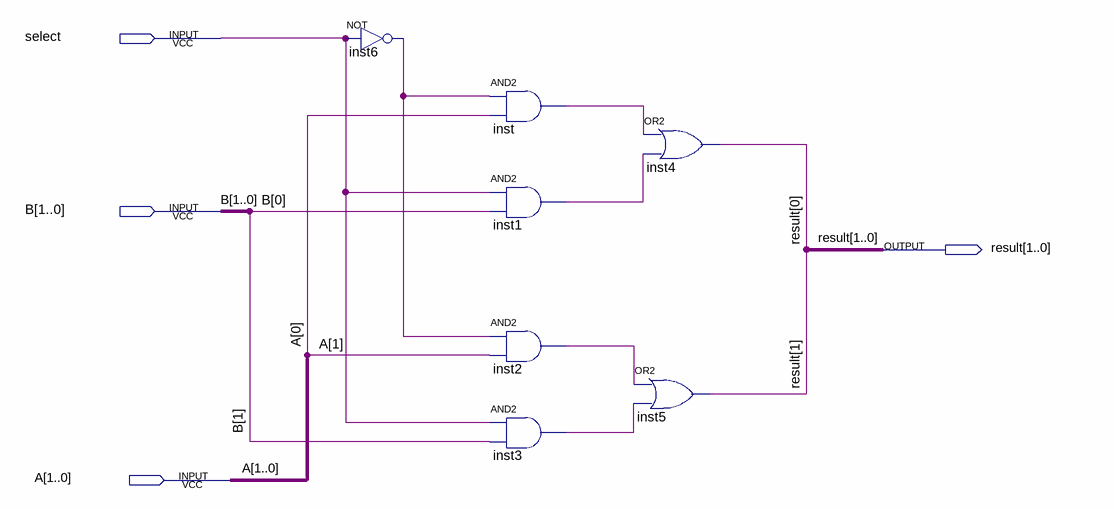
[diagram p0: schematic sheet]
// Quartus schematic MUX2.bdf as structural Verilog: 7 symbols, 4 pins
module MUX2 (
  input  select,
  input  [1:0] B,
  input  [1:0] A,
  output [1:0] result
);

  wire inst1_out, inst2_out, inst3_out, inst6_out, inst_out;

  not inst6 (inst6_out, select);
  and inst (inst_out, inst6_out, A[0]);
  and inst1 (inst1_out, select, B[0]);
  and inst2 (inst2_out, inst6_out, A[1]);
  and inst3 (inst3_out, select, B[1]);
  or inst4 (result[0], inst_out, inst1_out);
  or inst5 (result[1], inst2_out, inst3_out);
endmodule
